# EAGLE design lora (EAGLE 6.6.0)
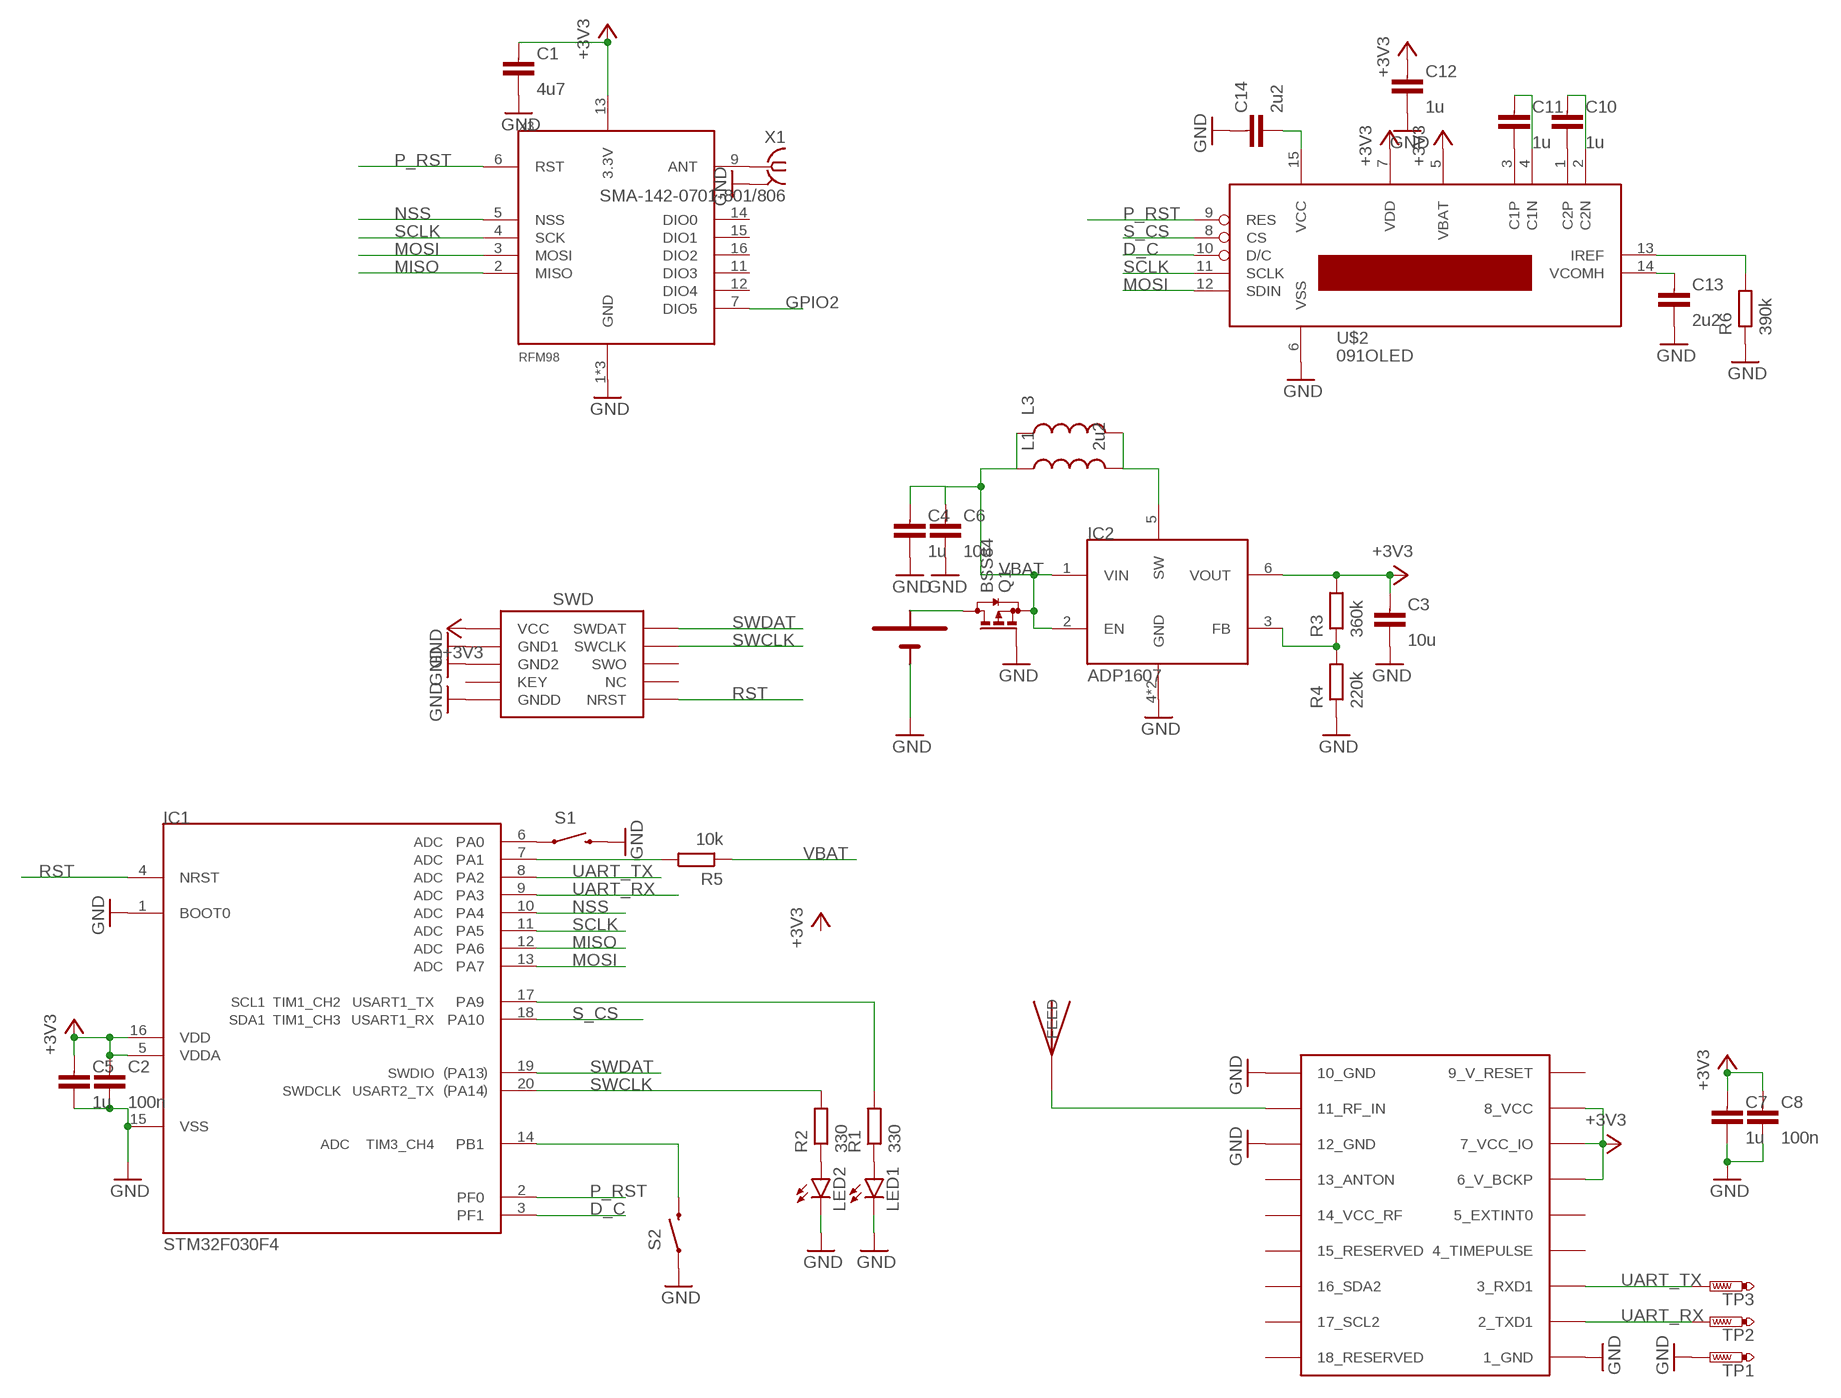
[diagram p0: schematic, sheet 1]

## Parts
C1  4u7  CAPACITOR0603-N  [C0603-N]
C2  100n  CAPACITOR0603-N  [C0603-N]
C3  10u  CAPACITOR0805-N  [C0805-N]
C4  1u  CAPACITOR0603-N  [C0603-N]
C5  1u  CAPACITOR0603-N  [C0603-N]
C6  10u  CAPACITOR0805-N  [C0805-N]
C7  1u  CAPACITOR0603-N  [C0603-N]
C8  100n  CAPACITOR0603-N  [C0603-N]
C10  1u  CAPACITOR0603-N  [C0603-N]
C11  1u  CAPACITOR0603-N  [C0603-N]
C12  1u  CAPACITOR0603-N  [C0603-N]
C13  2u2  CAPACITOR0603-N  [C0603-N]
C14  2u2  CAPACITOR0603-N  [C0603-N]
IC1  STM32F030F4  [TSSOP20]
IC2  ADP1607  [LFCSP6]
J1  SWD_PTH_SHROUD  [SWD_PTH_SHROUD]
L1  2u2  INDUCTOR0805  [0805]
L3  INDUCTOR1210  [1210]
LED1  LED0603  [LED-0603]
LED2  LED0603  [LED-0603]
Q1  BSS84  [SOT23]
R1  330  RESISTOR0603-N  [R0603-N]
R2  330  RESISTOR0603-N  [R0603-N]
R3  360k  RESISTOR0603-N  [R0603-N]
R4  220k  RESISTOR0603-N  [R0603-N]
R5  10k  RESISTOR0603-N  [R0603-N]
R6  390k  RESISTOR0603-N  [R0603-N]
S1  SWITCH-MOMENTARY-2SMD  [TACTILE_SWITCH_SMD]
S2  SWITCH-MOMENTARY-2SMD  [TACTILE_SWITCH_SMD]
TP1  PTR1B1,27  [B1,27]
TP2  PTR1B1,27  [B1,27]
TP3  PTR1B1,27  [B1,27]
U$2  091OLED  [0.91OLEDCON]
U$5  JTI_ANTENNA-1575AT43A40  [JTI_ANTENNA-1575AT43A40]
U$6  KEYSTONE-92  [KEYSTONE-92-AA-BATTERY]
X1  SMA-142-0701-801/806  [J502-ND-142-0701-801/806]
X2  UBLOX_MAX  [UBLOX_MAX]
X3  RFM98  [RFM97]

## Nets
+3V3: C1.1 C2.1 C3.1 C5.1 C7.1 C8.1 C12.1 IC1.5(VDDA) IC1.16(VDD) IC2.6(VOUT) J1.1(VCC) R3.2 U$2.5(VBAT) U$2.7(VDD) X2.6_V_BCKP X2.7_VCC_IO X2.8_VCC X3.13(3.3V)
D_C: IC1.3(PF1) U$2.10(D/C)
GND: C1.2 C2.2 C3.2 C4.2 C5.2 C6.2 C7.2 C8.2 C12.2 C13.2 C14.1 IC1.1(BOOT0) IC1.15(VSS) IC2.4(GND) IC2.EP(GND) J1.3(GND1) J1.5(GND2) J1.9(GNDD) LED1.C LED2.C Q1.1(G) R4.1 R6.1 S1.3 S2.1 TP1.TP U$2.6(VSS) U$6.GND2(-) U$6.GND(-) X1.G@1 X1.G@2 X1.G@3 X1.G@4 X2.1_GND X2.10_GND X2.12_GND X3.1(GND) X3.8(GND) X3.10(GND)
GPIO2: X3.7(DIO5)
MISO: IC1.12(PA6) X3.2(MISO)
MOSI: IC1.13(PA7) U$2.12(SDIN) X3.3(MOSI)
N$1: LED1.A R1.1
N$2: X1.1 X3.9(ANT)
N$3: IC2.5(SW) L1.2 L3.2
N$4: U$5.FEED X2.11_RF_IN
N$5: LED2.A R2.1
N$6: IC2.3(FB) R3.1 R4.2
N$7: Q1.3(D) U$6.VBATT1(+) U$6.VBATT(+)
N$8: IC1.14(PB1) S2.3
N$9: IC1.7(PA1) R5.2
N$11: C10.2 U$2.1(C2P)
N$12: C11.2 U$2.3(C1P)
N$13: C11.1 U$2.4(C1N)
N$14: C10.1 U$2.2(C2N)
N$15: C13.1 U$2.14(VCOMH)
N$16: R6.2 U$2.13(IREF)
N$18: IC1.6(PA0) S1.1
N$20: IC1.17(PA9) R1.2
NSS: IC1.10(PA4) X3.5(NSS)
P_RST: IC1.2(PF0) U$2.9(RES) X3.6(RST)
RST: IC1.4(NRST) J1.10(NRST)
S_CS: IC1.18(PA10) U$2.8(CS)
SCLK: IC1.11(PA5) U$2.11(SCLK) X3.4(SCK)
SWCLK: IC1.20(PA14) J1.4(SWCLK) R2.2
SWDAT: IC1.19(PA13) J1.2(SWDAT)
UART_RX: IC1.9(PA3) TP2.TP X2.2_TXD1
UART_TX: IC1.8(PA2) TP3.TP X2.3_RXD1
VBAT: C4.1 C6.1 IC2.1(VIN) IC2.2(EN) L1.1 L3.1 Q1.2(S) R5.1
VCC: C14.2 U$2.15(VCC)
Unconnected: J1.6(SWO) J1.7(KEY) J1.8(NC) X2.4_TIMEPULSE X2.5_EXTINT0 X2.13_ANTON X2.14_VCC_RF X2.15_RESERVED X2.16_SDA2 X2.17_SCL2 X2.18_RESERVED X3.11(DIO3) X3.12(DIO4) X3.14(DIO0) X3.15(DIO1) X3.16(DIO2)

## Power pins joined to a net without a drawn wire
9_V_RESET: X2.9_V_RESET

## Library data of the parts
C1-C8 C10-C14 = passives-7351:CAPACITOR
IC1 = dtb:STM32F030F4
IC2 = Mine:ADP1607
J1 = dtb:SWD_PTH_SHROUD
L1 L3 = SparkFun-Passives:INDUCTOR: Inductors Basic Inductor/Choke - 0603 and 1206. Footprints are not proven and vary greatly between part numbers. SRN6045- 33uH, 20% 1.4A SDR0403-560KL - 56uH, 10%, 500mA RMS/740mA peak
LED1 LED2 = SparkFun-LED:LED: LEDs Standard schematic elements and footprints for 5mm, 3mm, 1206, and 0603 sized LEDs. 5mm - Spark Fun Electronics SKU : COM-00529 (and others)
Q1 = transistor-small-signal:BSS84: P-CHANNEL MOS FET
R1-R6 = passives-7351:RESISTOR
S1 S2 = Mine:SWITCH-MOMENTARY-2: Various NO switches- pushbuttons, reed, etc
TP1-TP3 = testpad:PTR1: TEST PIN
U$2 = ukhas:091OLED
U$5 = Ava:JTI_ANTENNA-1575AT43A40
U$6 = Mine:KEYSTONE-92
X1 = con-coax:SMA-: SMA 50 Ohm End Launch Jack Receptacle - Round Contact Johnson Components Source: www.johnsoncomponents.com .. J502-ND.pdf; MF: JOHNSON COMPONENTS; MPN: 142-0701-801; OC_FARNELL: 1608592; OC_NEWARK: 90F2624
X2 = Ava:UBLOX_MAX: UBLOX MAX
X3 = Mine:RFM98

## Board
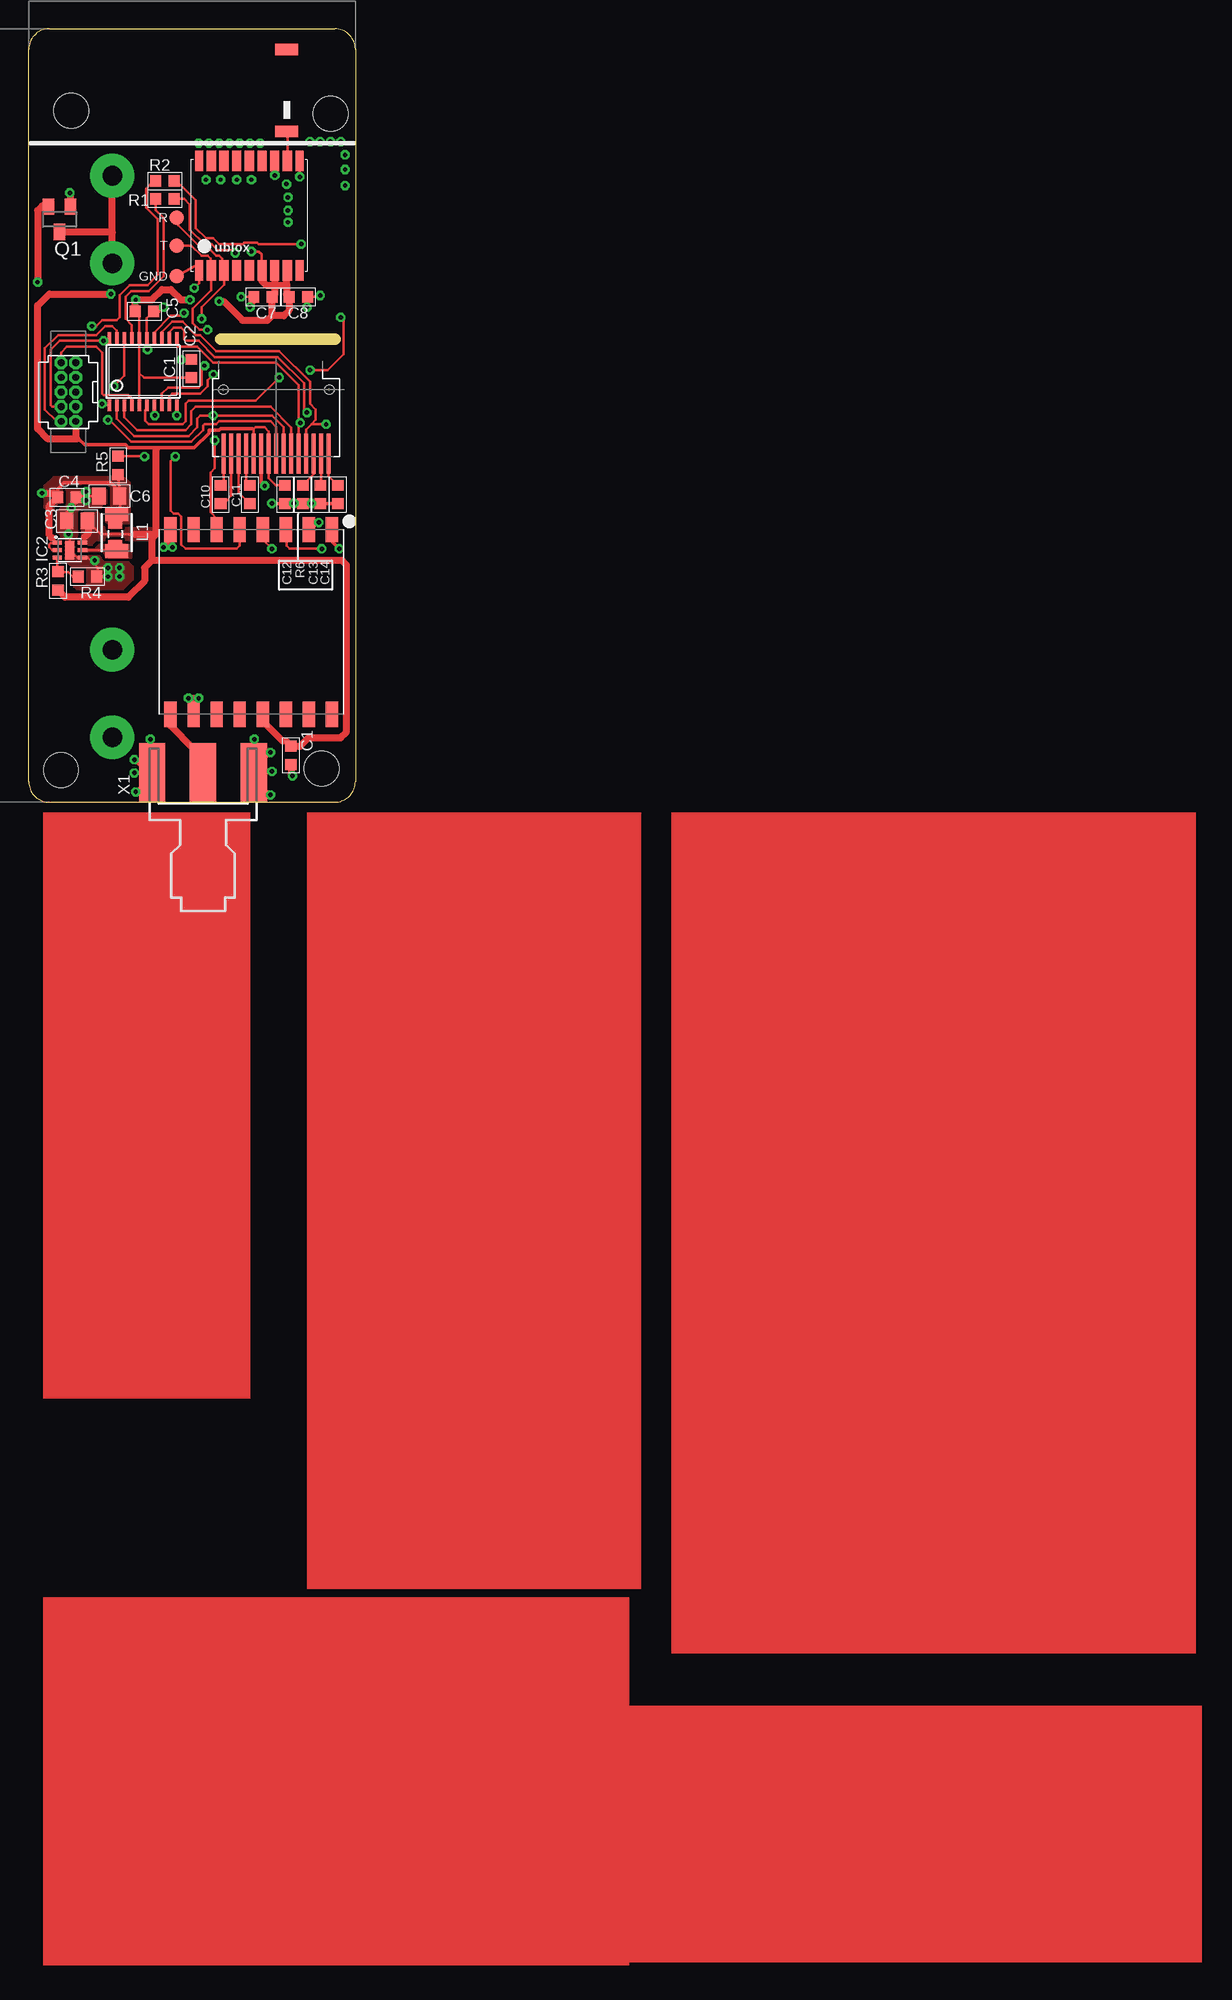
[diagram p1: board, top side]
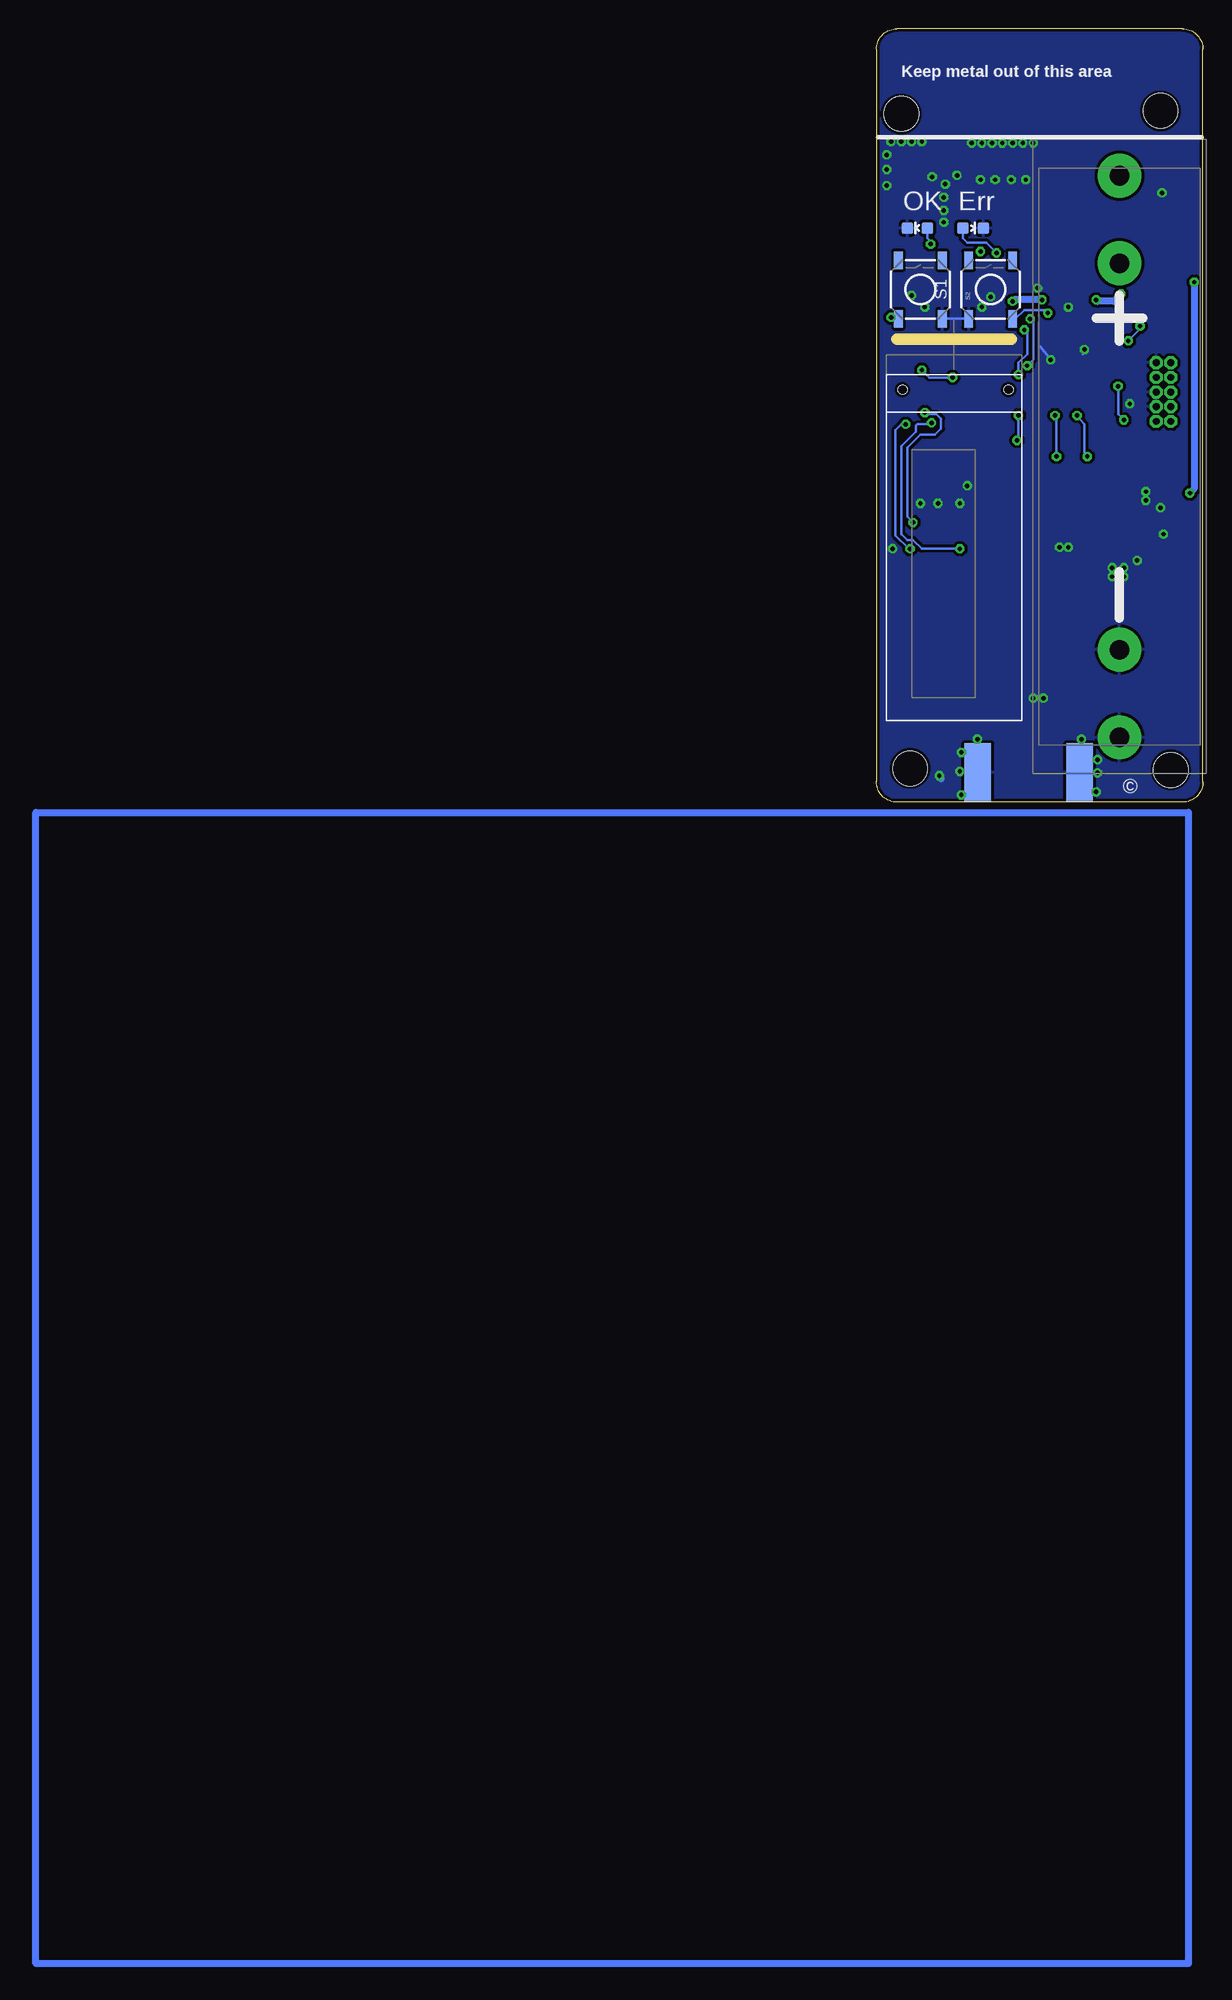
[diagram p2: board, bottom side, seen from below]

Size 28.32 x 67.06 mm. Coordinates in mm from the lower left corner, seen from the top.
Outline: 1.78,0 26.54,0 arc90 28.32,1.78 28.32,65.28 arc90 26.54,67.06 1.78,67.06 arc90 0,65.28 0,1.78 arc90 1.78,0
Copper layers (1*16): Top 0.035mm / dielectric 1.5mm / Bottom 0.035mm
Design rules "default *": minimum track width 8mil, minimum drill 15mil, track to track 8mil, track to pad 8mil, pad to pad 6mil, via to via 8mil, smd to smd 0mil, copper to edge 10mil, drill to drill 8mil, minimum pad ring 10mil, minimum via ring 8mil, stop-mask expansion 4mil, vias tented up to drill 15mil, thermal gap 10mil
Holes 3 mm at 3.68,59.94 26.16,59.69 25.4,2.92 2.79,2.79
Milling: 1 lines

### Footprints (pad centres in the part's own frame; a part is rotated, then mirrored left to right if it is on the bottom)
C0603-N = smd 0.95 x 1: 1 -0.8,0; 2 0.8,0
C0805-N = smd 1.15 x 1.45: 1 -0.9,0; 2 0.9,0
TSSOP20 = smd 0.305 x 0.991: 1 -2.925,-2.918; 2 -2.275,-2.918; 3 -1.625,-2.918; 4 -0.975,-2.918; 5 -0.325,-2.918; 6 0.325,-2.918; 7 0.975,-2.918; 8 1.625,-2.918; 9 2.275,-2.918; 10 2.925,-2.918; 11 2.925,2.918; 12 2.275,2.918; 13 1.625,2.918; 14 0.975,2.918; 15 0.325,2.918; 16 -0.325,2.918; 17 -0.975,2.918; 18 -1.625,2.918; 19 -2.275,2.918; 20 -2.925,2.918
LFCSP6 = smd 0.35 x 0.8: 1 -0.65,-1.1; 2 0,-1.1; 3 0.65,-1.1; 4 0.65,1.1; 5 0,1.1; 6 -0.65,1.1 | smd 1.6 x 0.8: EP 0,0
SWD_PTH_SHROUD = drill 0.6 octagon: 1 -2.54,-0.635; 2 -2.54,0.635; 3 -1.27,-0.635; 4 -1.27,0.635; 5 0,-0.635; 6 0,0.635; 7 1.27,-0.635; 8 1.27,0.635; 9 2.54,-0.635; 10 2.54,0.635
0805 = smd 0.8 x 1.2: 1 -0.9,0; 2 0.9,0
1210 = smd 1.2 x 2: 1 -1.6,0; 2 1.6,0
LED-0603 = smd 1 x 1: A 0,-0.877; C 0,0.877
SOT23 = smd 1 x 1.4: 1 -0.95,-1.1; 2 0.95,-1.1; 3 0,1.1
R0603-N = smd 0.95 x 1: 1 -0.8,0; 2 0.8,0
TACTILE_SWITCH_SMD = smd 1.524 x 0.762: 1 -2.54,1.905; 2 2.54,1.905; 3 -2.54,-1.905; 4 2.54,-1.905
B1,27 = smd 1.27 x 1.27: TP 0,0
0.91OLEDCON = smd 3.5 x 0.35: 1 -0.25,-4.55; 2 -0.25,-3.9; 3 -0.25,-3.25; 4 -0.25,-2.6; 5 -0.25,-1.95; 6 -0.25,-1.3; 7 -0.25,-0.65; 8 -0.25,0; 9 -0.25,0.65; 10 -0.25,1.3; 11 -0.25,1.95; 12 -0.25,2.6; 13 -0.25,3.25; 14 -0.25,3.9; 15 -0.25,4.55 | hole 0.8: -5.8,4.6; -5.8,-4.6
JTI_ANTENNA-1575AT43A40 = smd 1 x 2: FEED -3.175,0; NC 3.925,0
KEYSTONE-92-AA-BATTERY = drill 1.7 pad 3.81: GND -24.35,0; GND2 -16.75,0; VBATT 16.75,0; VBATT1 24.35,0
J502-ND-142-0701-801/806 = smd 5.08 x 2.286: 1 2.565,0; G@1 2.565,4.42; G@2 2.565,-4.42 | smd 5.08 x 2.286 bottom: G@3 2.565,4.42; G@4 2.565,-4.42
UBLOX_MAX = smd 1.8 x 0.7: 1_GND 4.95,-4.4; 9_V_RESET 4.95,4.3; 10_GND -4.55,4.3; 18_RESERVED -4.55,-4.4 | smd 1.8 x 0.8: 2_TXD1 4.95,-3.35; 3_RXD1 4.95,-2.25; 4_TIMEPULSE 4.95,-1.15; 5_EXTINT0 4.95,-0.05; 6_V_BCKP 4.95,1.05; 7_VCC_IO 4.95,2.15; 8_VCC 4.95,3.25; 11_RF_IN -4.55,3.25; 12_GND -4.55,2.15; 13_ANTON -4.55,1.05; 14_VCC_RF -4.55,-0.05; 15_RESERVED -4.55,-1.15; 16_SDA2 -4.55,-2.25; 17_SCL2 -4.55,-3.35
RFM97 = smd 2.184 x 1.067: 1 0,0; 2 0,-2; 3 0,-4; 4 0,-6; 5 0,-8; 6 0,-10; 7 0,-12; 8 0,-14; 9 16,-14; 10 16,-12; 11 16,-10; 12 16,-8; 13 16,-6; 14 16,-4; 15 16,-2; 16 16,0

### Placement (x,y rotation side)
C1  22.73,4.06 270 top
C2  14.1,37.59 90 top
C3  4.19,24.38 180 top
C4  3.3,26.42 0 top
C5  10.03,42.55 0 top
C6  6.98,26.54 180 top
C7  20.32,43.81 180 top
C8  23.37,43.81 0 top
C10  16.64,26.67 90 top
C11  19.18,26.67 270 top
C12  22.23,26.67 270 top
C13  25.27,26.67 270 top
C14  26.8,26.67 90 top
IC1  9.91,37.34 0 top
IC2  3.56,21.84 270 top
J1  3.43,35.56 90 top
L1  7.49,23.24 270 top
L3  7.62,23.37 270 top
LED1  19.94,49.78 270 bottom
LED2  24.77,49.78 90 bottom
Q1  2.67,50.55 180 top
R1  11.81,52.32 180 top
R2  11.81,53.85 180 top
R3  2.54,19.18 270 top
R4  5.08,19.56 180 top
R5  7.75,29.21 90 top
R6  23.75,26.67 90 top
S1  24.51,44.45 90 bottom
S2  18.41,44.45 90 bottom
TP1  12.83,45.59 0 top
TP2  12.83,48.26 0 top
TP3  12.83,50.67 0 top
U$2  21.46,29.97 270 top
U$3  [0.91OLEDPANEL]  22.48,20.32 90 bottom
U$5  22.35,61.34 90 top
U$6  7.24,29.97 90 bottom
X1  15.11,0 90 top
X2  19.18,51.05 270 top
X3  26.29,23.62 270 top

### Tracks (layer width: path | path; a pad name or v marks a point on that pad's centre or on a via)
+3V3  (via drill 0.38)
  Top 0.203: C12.1 21.43,27.47 20.81,28.08 U$2.7 20.81,32.15 20.45,32.51 19.69,32.51 19.51,32.34 19.43,32.38 19.51,32.3 U$2.5 | 4.83,22.99 4.83,22.66 IC2.6 | C3.1 5.14,24.32 6.22,23.24 8.64,23.24 | 9.58,37.21 IC1.16 9.58,42.13 C5.1 | 9.58,37.21 IC1.5 | C2.1 10,36.79 9.58,37.21 | v19.3,47.75 19.94,47.75 20.19,47.5 20.19,46.14 X2.6_V_BCKP
  Top 0.254: 8.64,23.24 9.14,23.24
  Top 0.305: 19.43,32.38 16.64,32.38 16.51,32.26 15.62,32.26 15.62,32 14.35,30.73 10.79,30.73 | 10.79,30.73 8.64,30.73 8.38,30.99 4.83,30.99 4.32,31.5 4.19,31.5 | 11.05,30.61 10.79,30.73
  Top 0.61: 10.67,20.95 27.18,20.95 27.56,20.57 27.56,6.1 27.05,5.59 24.26,5.59 23.53,4.86 C1.1 22.26,5.33 21.97,5.33 20.29,7.02 X3.13 | R3.2 3.14,17.78 8.64,17.78 10.03,19.18 10.03,20.32 10.67,20.95 | v7.11,44.07 1.78,44.07 0.76,43.05 0.76,32.38 1.65,31.5 4.19,31.5 4.06,31.62 J1.1 | 9.14,23.24 11.05,23.24 | C3.1 5.14,23.3 4.83,22.99 | v13.97,43.56 13.21,43.56 12.32,44.45 11.56,44.45 10.67,43.56 v9.27,43.56 9.23,43.52 C5.1 | v16.51,43.43 16.89,43.43 18.54,41.78 20.7,41.78 21.08,42.16 | 21.08,42.16 21.08,43.78 C7.1 21.33,44.02 X2.7_VCC_IO | 21.08,42.16 22.1,42.16 22.57,42.63 C8.1 22.35,44.03 22.35,44.96 | X2.6_V_BCKP 20.23,45.18 20.57,44.83 22.23,44.83 22.35,44.96 | 22.35,44.96 22.35,46.03 X2.8_VCC | 11.05,23.24 11.05,30.61 | 11.05,23.24 10.67,22.86 10.67,20.95
  Bottom 0.203: 19.32,47.74 v19.3,47.75
  Bottom 0.61: v7.11,44.07 7.75,43.43 9.14,43.43 v9.27,43.56 | v13.97,43.56 16.38,43.56 v16.51,43.43
  pour Top (isolate 0.254, rank 2, no thermals): 5.08,25.15 5.97,25.15 6.22,24.89 6.22,24.13 6.6,23.75 10.79,23.75 10.92,23.88 10.92,22.73 5.84,22.73 5.46,22.35 4.06,22.35 3.94,22.48 3.94,24.77 4.32,25.15
D_C
  Top 0.203: U$2.10 22.76,32.48 20.96,34.29 14.48,34.29 14.1,33.91 14.1,32.77 13.59,32.26 9.4,32.26 8.28,33.38 IC1.3
GND  (via drill 0.38)
  Top 0.203: 5.97,20.32 5.09,21.19 IC2.4 4.21,21.19 IC2.EP 3.56,23.11 v3.43,23.24 3.43,23.88 3.24,24.06 C3.2 3.24,25.09 v3.68,25.53 4.1,25.95 C4.2 4.23,26.54 4.57,26.54 | 5.97,20.32 5.97,19.65 R4.1 v6.86,19.56 | C6.2 4.57,26.54 | v10.29,39.24 10.23,39.3 IC1.15 10.23,41.98 10.79,42.55 | C2.2 v13.21,38.35 | 5.97,20.32 v6.86,20.32 | 4.57,26.54 v4.95,26.16 | v25.27,43.94 25.4,43.81 C8.2 24.17,42.96 v24.13,42.93 | v18.41,43.81 C7.2 19.52,43.27 v19.18,42.93 | TP1.TP 14.4,46.48 X2.1_GND 14.78,45 v14.35,44.58 | X2.12_GND v21.33,54.37 v21.34,54.36 | X2.10_GND 23.48,54.25 v23.5,54.23 | C5.2 11.3,42.55 v11.68,42.93 | IC1.1 6.47,34.42 v6.35,34.54 | 4.57,26.54 v4.95,26.92
  Top 0.305: v9.27,0.89 10.69,2.31 X1.G@3 10.26,2.56 v9.14,3.68 | v9.14,2.54 9.02,2.54 | v10.54,5.46 10.54,5.59 | X1.G@4 19.53,5.44 v19.56,5.46 | X1.G@4 19.53,2.06 v20.96,0.64 | X1.G@4 20.98,2.56 v21.08,2.67 | X1.G@4 19.53,2.9 v20.96,4.32 | X3.10 14.29,8.96 v14.73,9.02 | U$2.6 20.16,27.72 v20.45,27.43 | v21.08,25.91 21.12,25.87 C12.2 22.95,25.87 v22.99,25.91 23.03,25.87 R6.1 24.47,25.87 v24.51,25.91 24.55,25.87 C13.2 C14.1 | X3.1 26.29,22.61 v26.92,21.97
  Top 0.61: C1.2 22.73,2.41 v22.86,2.29 | X3.8 12.29,22.25 v12.45,22.1 12.45,22.22 12.07,22.61 12.07,22.48 v11.68,22.1 | v13.84,9.02 v14.73,9.02 | Q1.1 3.62,52.77 v3.56,52.83
  Bottom 0.203: v10.29,39.24 10.29,38.99 10.41,38.86 | v13.21,38.35 14.1,39.5 | v11.68,22.1 12.19,21.97 | v6.86,20.32 7.11,20.32 | v4.95,26.16 5.08,26.04 | v25.27,43.94 25.53,44.2 | v18.41,43.81 18.16,43.81 | v14.35,44.58 13.97,44.58 | v21.34,54.36 21.34,54.23 | v23.5,54.23 23.5,54.1 | S1.3 S2.1 | v11.68,42.93 11.68,43.05 | v6.35,34.54 6.35,34.67 | v6.86,19.56 6.98,19.56 | v3.68,25.53 3.68,25.4 | v3.43,23.24 3.3,23.24 3.17,23.37 | v4.95,26.92 4.95,27.05 | v24.13,42.93 24.13,42.67 | v19.18,42.93 19.18,42.8
  Bottom 0.305: v9.27,0.89 9.14,0.89 | v9.14,2.54 9.17,2.56 X1.G@3 10.69,5.31 v10.54,5.46 | v9.14,3.68 9.02,3.68 | v19.56,5.46 19.56,5.59 | v20.96,0.64 21.08,0.64 | v21.08,2.67 21.08,2.92 | v20.96,4.32 21.08,4.45 | v14.73,9.02 14.35,9.14 | v20.45,27.43 20.45,27.3 | v21.08,25.91 20.96,26.04 | v22.99,25.91 22.99,26.04 | v24.51,25.91 24.51,26.04 | v26.92,21.97 26.8,21.97
  Bottom 0.61: v22.86,2.29 22.86,2.16 22.73,2.03 | v3.56,52.83 3.56,52.96
  other vias: 5.71,20.95 7.87,20.32 7.87,19.56 20.07,57.15 19.18,57.15 18.29,57.15 17.4,57.15 16.51,57.15 15.62,57.15 14.73,57.15 15.37,53.98 16.64,53.98 18.03,53.98 19.3,53.98 22.35,53.59 22.48,52.45 22.48,51.31 22.48,50.29 24.38,57.28 25.27,57.28 26.16,57.28 27.05,57.28 27.43,56.13 27.43,54.86 27.43,53.47
  pour Bottom (isolate 0.254): -0.64,69.09 30.99,69.09 30.99,-4.32 -3.68,-4.32 -3.68,65.79
  pour Top (isolate 0.254, no thermals): 4.19,18.41 8.13,18.41 9.02,19.3 9.02,20.45 8.64,20.83 6.6,20.83 6.1,21.34 4.57,21.34 4.19,21.72 4.19,23.62 4.32,23.75 4.32,25.27 4.57,25.53 6.48,25.53 6.73,25.78 6.73,27.05 6.35,27.18 3.3,27.18 3.17,27.05 3.17,25.91 2.54,25.27 2.54,23.37 2.79,23.11 2.79,21.34 3.81,20.32 3.81,18.8
MISO  (via drill 0.38)
  Top 0.203: IC1.12 12.18,40.76 12.57,41.15 13.21,41.15 13.46,40.89 13.46,40.13 13.59,40.01 14.73,40.01 16.13,38.61 21.59,38.61 23.88,36.32 23.88,34.04 v24.13,33.78 | X3.2 24.51,23.62 v25.15,24.26
  Bottom 0.203: 24.13,33.66 v24.13,33.78 24,33.66 23.11,33.66 22.73,33.27 22.73,32.38 23.24,31.88 24.51,31.88 25.65,30.73 25.65,24.77 v25.15,24.26
MOSI  (via drill 0.38)
  Top 0.203: U$2.12 24.06,32.32 24.51,32.77 | 24.51,32.77 v25.78,32.77 | v25.4,21.97 22.61,21.97 22.35,22.22 22.35,23.56 X3.3 | IC1.13 11.53,40.74 12.45,41.66 13.34,41.66 14.48,40.51 14.86,40.51 16.26,39.12 21.72,39.12 24.38,36.45 24.38,34.54 24.89,34.04 24.89,33.15 24.51,32.77
  Bottom 0.203: v25.78,32.77 26.16,32.77 26.67,32.26 26.67,23.11 25.53,21.97 v25.4,21.97
N$1  (via drill 0.38)
  Top 0.203: R1.1 13.46,52.32 13.97,51.82 13.97,49.66 15.24,48.39 15.88,48.39 16.38,47.88 17.65,47.88 v17.91,47.62
  Bottom 0.203: v17.91,47.62 18.8,48.51 20.45,48.51 20.83,48.89 20.83,49.77 LED1.A
N$2
  Top 0.61: X3.9 12.29,6.63 14.22,4.7 14.22,4.19 15.37,3.05 15.37,2.82 X1.1
N$3
  Top 0.203: IC2.5 7.54,21.84 L3.2 7.49,21.89 L1.2
  pour Top (isolate 0.254, rank 5, no thermals): 4.45,22.48 6.22,22.48 6.73,22.99 8.38,22.99 8.89,22.48 8.89,21.21 8.51,20.83 4.45,20.83 3.94,21.34 3.94,22.35 4.06,22.48
N$4
  Top 0.203: X2.11_RF_IN 22.43,58.09 U$5.FEED
N$5  (via drill 0.38)
  Top 0.203: R2.1 12.83,53.85 14.48,52.2 14.48,49.78 15.37,48.89 16,48.89 16.51,48.39 18.54,48.39 18.67,48.51 19.81,48.51 19.94,48.39 v23.62,48.39
  Bottom 0.203: LED2.A 23.89,48.91 23.37,48.39 v23.62,48.39
N$6
  Top 0.203: IC2.3 2.46,20.06 R3.1 2.58,19.94 3.43,19.94 3.81,19.56 R4.2
N$7
  Top 0.61: U$6.VBATT 7.24,49.4 | 7.24,49.4 U$6.VBATT1 | Q1.3 7.2,49.45 7.24,49.4
N$8  (via drill 0.38)
  Top 0.203: IC1.14 10.88,40.73 12.32,42.16 13.21,42.16 v13.46,42.42
  Bottom 0.203: S2.3 16.26,41.91 15.49,42.67 13.72,42.67 v13.46,42.42
N$9  (via drill 0.38)
  Top 0.203: v10.92,33.53 10.92,34.38 IC1.7 | R5.2 9.56,30.01 v10.03,29.97
  Bottom 0.203: v10.92,33.53 10.29,32.77 10.29,30.23 v10.03,29.97
N$10
  Bottom 0.61: 1.27,-0.89 1.27,-100.71 101.22,-100.71 101.22,-0.89 1.27,-0.89
N$11
  Top 0.203: U$2.1 16.91,27.75 C10.2
N$12
  Top 0.203: U$2.3 18.21,26.83 C11.2
N$13
  Top 0.203: U$2.4 18.86,27.78 C11.1
N$14
  Top 0.203: U$2.2 17.56,26.58 17.14,26.16 16.93,26.16 C10.1
N$15
  Top 0.203: U$2.14 25.36,27.81 C13.1
N$16
  Top 0.203: U$2.13 24.71,28.43 R6.2
N$18  (via drill 0.38)
  Top 0.203: v21.72,36.83 19.69,34.8 13.84,34.8 13.59,34.54 13.59,33.02 13.34,32.77 10.41,32.77 10.1,33.08 10.1,33.97 10.23,34.11 IC1.6 | v24.38,37.46 25.91,37.46 27.3,38.86 27.3,41.78 v27.05,42.04
  Bottom 0.203: v21.72,36.83 23.75,36.83 v24.38,37.46 | v27.05,42.04 26.54,42.04 S1.1
N$20
  Top 0.203: IC1.17 8.93,41.36 8.38,41.91 8.38,43.81 8.89,44.32 10.41,44.32 11.68,45.59 11.68,50.67 11.01,51.35 R1.2
NSS  (via drill 0.38)
  Top 0.203: IC1.10 12.83,33.66 v12.83,33.53 | v12.7,29.97 12.32,29.59 12.32,25.27 12.57,25.02 12.95,25.02 13.21,24.77 13.21,22.35 13.59,21.97 18.03,21.97 18.29,22.22 X3.5 18.16,23.75
  Bottom 0.203: v12.7,29.97 12.7,33.4 v12.83,33.53
P_RST  (via drill 0.38)
  Top 0.203: v16.13,31.37 16.13,28.96 15.75,28.57 15.75,25.15 16.29,24.61 X3.6 | U$2.9 22.11,32.5 21.08,33.53 v16,33.53 14.86,33.53 14.61,33.27 14.61,32.51 13.84,31.75 9.14,31.75 7.62,33.27 7.62,34.41 IC1.2
  Bottom 0.203: v16,33.53 16,31.62 v16.13,31.37
RST
  Top 0.203: J1.10 2.79,38.99 3.3,39.5 5.84,39.5 6.35,38.99 6.35,35.43 6.48,35.31 8.64,35.31 8.93,35.01 IC1.4
S_CS  (via drill 0.38)
  Top 0.203: U$2.8 21.46,32.51 20.96,33.02 16.51,33.02 16.26,32.77 15.24,32.77 15.11,32.64 15.11,32.26 14.1,31.24 8.89,31.24 6.98,33.15 v6.86,33.15 | IC1.18 8.28,36.98 v7.37,36.07
  Bottom 0.203: v7.37,36.07 7.37,33.66 v6.86,33.15
SCLK  (via drill 0.38)
  Top 0.203: X3.4 20.29,22.76 v21.08,21.97 | U$2.11 23.41,32.77 v23.54,32.89 23.41,33.02 23.41,36.15 21.46,38.1 16,38.1 14.61,39.5 12.95,39.5 12.83,39.62 IC1.11
  Bottom 0.203: v21.08,21.97 24.38,21.97 25.15,22.73 25.65,22.73 26.16,23.24 26.16,30.86 24.89,32.13 24.89,32.64 24.77,32.77 23.67,32.77 v23.54,32.89
SWCLK  (via drill 0.38)
  Top 0.203: J1.4 2.03,34.29 1.91,34.42 1.91,39.24 2.67,40.01 v6.48,40.01 6.73,40.01 IC1.20 | R2.2 10.79,53.85 10.16,53.21 10.16,51.56 11.18,50.55 11.18,45.72 10.29,44.83 8.76,44.83 7.87,43.94 7.87,42.04 7.62,41.78 6.35,41.78 5.84,41.27 v5.46,41.27
  Bottom 0.203: v5.46,41.27 5.46,41.02 v6.48,40.01
SWDAT
  Top 0.203: J1.2 2.41,33.02 1.4,34.04 1.4,39.37 2.54,40.51 5.84,40.51 6.6,41.27 7.24,41.27 7.63,40.88 IC1.19
UART_RX  (via drill 0.38)
  Top 0.203: TP2.TP 14.1,48.26 14.99,47.37 15.49,47.37 15.75,47.12 15.75,46.18 X2.2_TXD1 15.83,44.4 14.22,42.8 14.22,41.53 14.79,40.96 v15.49,40.96 | IC1.9 12.18,35.17 12.45,35.43 14.86,35.43 15.49,36.07 15.49,36.58 v16,37.08
  Bottom 0.203: v16,37.08 16,38.1 15.24,38.86 15.24,40.77 v15.49,40.96
UART_TX  (via drill 0.38)
  Top 0.203: IC1.8 11.53,35.41 12.07,35.94 14.73,35.94 14.99,36.2 14.99,37.59 v15.24,37.85 | v14.99,41.91 14.99,42.93 16.93,44.87 X2.3_RXD1 16.76,46.27 16.76,47.12 16.51,47.37 16.26,47.37 15.75,47.88 15.11,47.88 12.95,50.04 TP3.TP
  Bottom 0.203: v15.24,37.85 14.73,38.35 14.73,41.66 v14.99,41.91
VBAT  (via drill 0.38)
  Top 0.203: IC2.2 2.03,21.84 1.78,22.1 1.78,22.35 1.91,22.48 2.44,22.48 IC2.1 2.03,22.92 | C4.1 2.41,26.42 | L1.1 7.49,24.84 L3.1 7.93,25.28 C6.1 R5.1
  Top 0.305: C4.1 2.5,27.14 3.05,27.69 7.11,27.69 7.75,27.05 7.75,26.73 C6.1
  Top 0.61: 2.03,22.92 1.97,22.92 1.78,23.11 1.78,25.69 C4.1 2.12,26.8 v1.14,26.8 | v0.76,45.09 0.76,51.31 1.14,51.69 1.67,51.69 Q1.2
  Bottom 0.61: v0.76,45.09 0.76,27.18 v1.14,26.8
  pour Top (isolate 0.254, rank 3, no thermals): 6.98,23.75 8.38,23.75 8.76,24.13 8.76,27.69 8.38,28.07 7.87,28.07 7.75,28.19 2.16,28.19 1.4,27.43 1.4,25.53 1.65,25.27 2.92,25.27 3.43,25.78 3.43,26.92 3.68,27.18 6.6,27.18 6.73,27.05 6.73,24
VCC
  Top 0.203: U$2.15 26.01,28.25 C14.2
(copper drawn outside any net)
  shapes: Top area x5

### Text on the board
tPlace: R | T | GND
bPlace: Keep metal out of this area | Err | OK | ©
tNames: IC2